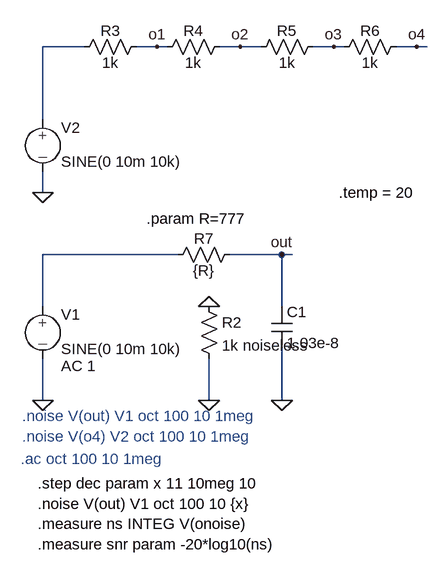
[diagram p0: schematic noise_snr.asc]
noise_snr.asc, the LTspice schematic file:
Version 4
SHEET 1 880 680
WIRE 64 -208 0 -208
WIRE 176 -208 144 -208
WIRE 192 -208 176 -208
WIRE 304 -208 272 -208
WIRE 336 -208 304 -208
WIRE 448 -208 416 -208
WIRE 464 -208 448 -208
WIRE 576 -208 544 -208
WIRE 592 -208 576 -208
WIRE 0 -96 0 -208
WIRE 0 16 0 -16
WIRE 208 112 0 112
WIRE 368 112 288 112
WIRE 384 112 368 112
WIRE 0 192 0 112
WIRE 368 192 368 112
WIRE 0 336 0 272
WIRE 256 336 256 272
WIRE 368 336 368 256
FLAG 368 336 0
FLAG 0 336 0
FLAG 256 336 0
FLAG 368 112 out
FLAG 0 16 0
FLAG 176 -208 o1
FLAG 304 -208 o2
FLAG 448 -208 o3
FLAG 576 -208 o4
FLAG 256 192 0
SYMBOL res 240 176 R0
SYMATTR InstName R2
SYMATTR Value 1k noiseless
SYMBOL cap 352 192 R0
SYMATTR InstName C1
SYMATTR Value 1.03e-8
SYMBOL MDB_sym\\source-V 0 176 R0
WINDOW 123 28 107 Left 2
WINDOW 39 0 0 Left 2
SYMATTR Value2 AC 1
SYMATTR InstName V1
SYMATTR Value SINE(0 10m 10k)
SYMBOL res 48 -192 R270
WINDOW 0 25 56 VTop 2
WINDOW 3 7 56 VBottom 2
SYMATTR InstName R3
SYMATTR Value 1k
SYMBOL MDB_sym\\source-V 0 -112 R0
WINDOW 123 0 0 Left 2
WINDOW 39 0 0 Left 2
SYMATTR InstName V2
SYMATTR Value SINE(0 10m 10k)
SYMBOL res 176 -192 R270
WINDOW 0 25 56 VTop 2
WINDOW 3 7 56 VBottom 2
SYMATTR InstName R4
SYMATTR Value 1k
SYMBOL res 320 -192 R270
WINDOW 0 25 56 VTop 2
WINDOW 3 7 56 VBottom 2
SYMATTR InstName R5
SYMATTR Value 1k
SYMBOL res 448 -192 R270
WINDOW 0 25 56 VTop 2
WINDOW 3 7 56 VBottom 2
SYMATTR InstName R6
SYMATTR Value 1k
SYMBOL res 192 128 R270
WINDOW 0 25 56 VTop 2
WINDOW 3 7 56 VBottom 2
SYMATTR InstName R7
SYMATTR Value {R}
TEXT -32 360 Left 2 ;.noise V(out) V1 oct 100 10 1meg
TEXT -8 464 Left 2 !.step dec param x 11 10meg 10\n.noise V(out) V1 oct 100 10 {x}\n.measure ns INTEG V(onoise)\n.measure snr param -20*log10(ns)
TEXT -32 392 Left 2 ;.noise V(o4) V2 oct 100 10 1meg
TEXT -34 426 Left 2 ;.ac oct 100 10 1meg
TEXT 456 16 Left 2 !.temp = 20
TEXT 160 56 Left 2 !.param R=777

The netlist it stands for:
* noise_snr.asc
R2 0 0 1k noiseless
C1 out 0 1.03e-8
V1 N002 0 SINE(0 10m 10k) AC 1
R3 N001 o1 1k
V2 N001 0 SINE(0 10m 10k)
R4 o1 o2 1k
R5 o2 o3 1k
R6 o3 o4 1k
R7 N002 out {R}
* .noise V(out) V1 oct 100 10 1meg
.step dec param x 11 10meg 10
.noise V(out) V1 oct 100 10 {x}
.measure ns INTEG V(onoise)
.measure snr param -20*log10(ns)
* .noise V(o4) V2 oct 100 10 1meg
* .ac oct 100 10 1meg
.temp = 20
.param R=777
.backanno
.end